# Altium schematic sheet FTDI.SchDoc
size B; SheetNumber: 5; SheetTotal: 7
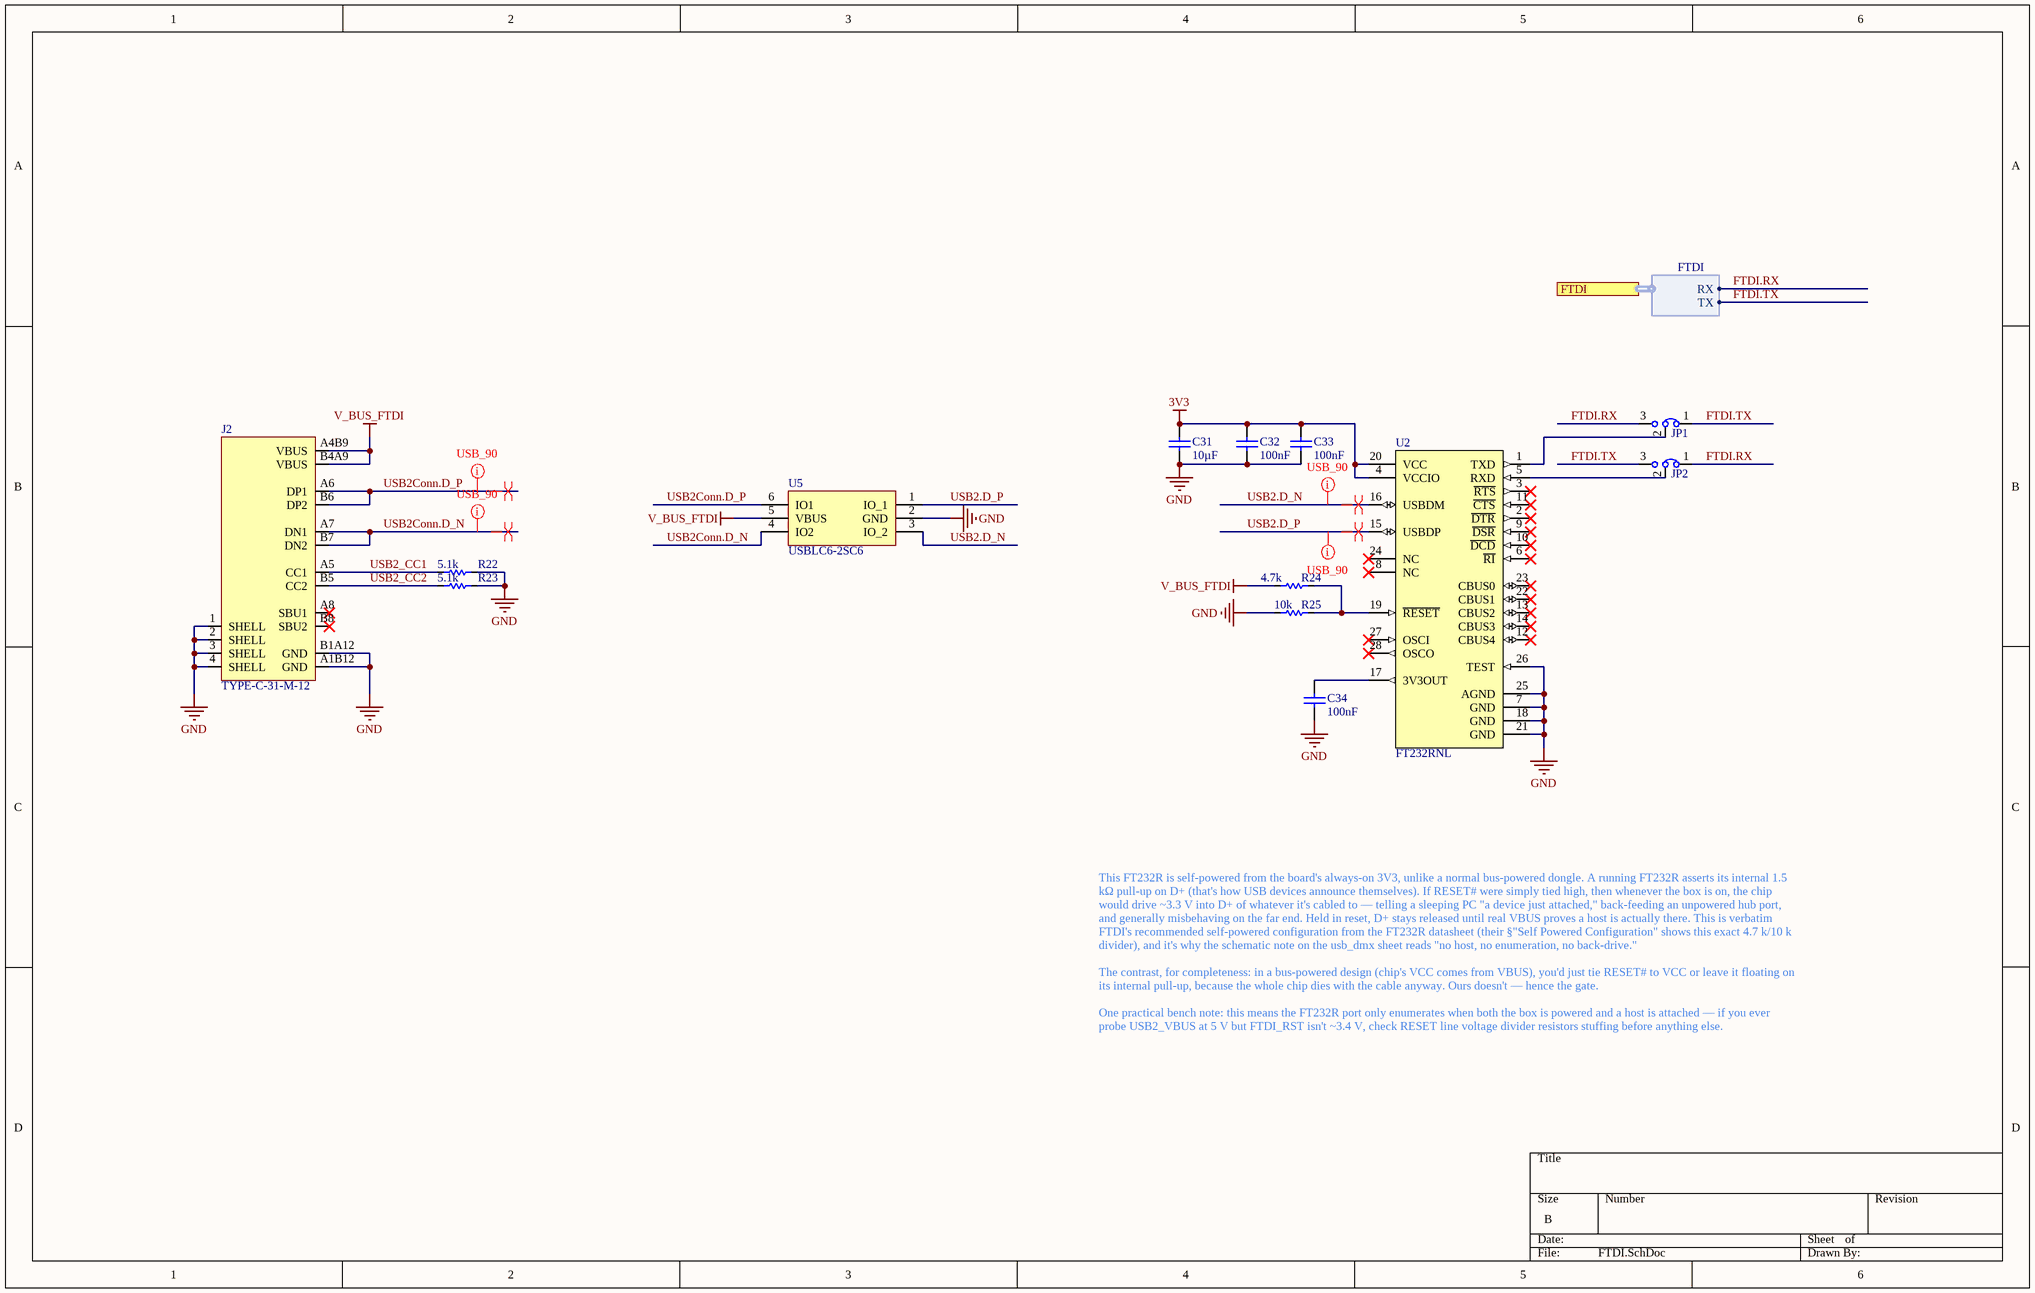
[diagram p0: FTDI.SchDoc]

## Parts
C31  value 10µF  [CAPC2012X14N_0805_MED]  (hidden comment: GRM21BC81C106KA73L)
C32  value 100nF  [CAPC1608X10N_0603_MED]  (hidden comment: CC0603KRX7R0BB104)
C33  value 100nF  [CAPC1608X10N_0603_MED]  (hidden comment: CC0603KRX7R0BB104)
C34  value 100nF  [CAPC1608X10N_0603_MED]  (hidden comment: CC0603KRX7R0BB104)
J2  TYPE-C-31-M-12  [Type-C-31-M-12]
JP1  Jumper 3 x 1 Bridge 1-2 Solder Bridge  [Jumper 3 Solder Bridge 1-2 0603]  (value not drawn)
JP2  Jumper 3 x 1 Bridge 1-2 Solder Bridge  [Jumper 3 Solder Bridge 1-2 0603]  (value not drawn)
R22  value 5.1k  [RESC1608X06N_0603_MED]  (hidden comment: RC0603FR-075K1L)
R23  value 5.1k  [RESC1608X06N_0603_MED]  (hidden comment: RC0603FR-075K1L)
R24  value 4.7k  [RESC1608X06N_0603_MED]  (hidden comment: RC0603FR-074K7L)
R25  value 10k  [RESC1608X06N_0603_MED]  (hidden comment: RC0603FR-1010KL)
U2  FT232RNL  [FP-FT232RNL-REEL-MFG]
U5  USBLC6-2SC6  [ESD_SOT23-6L]

## Ports
FTDI (harness FTDI)

## Harnesses
FTDI: RX, TX

## Nets
3V3: C31.2 C32.1 C33.1 U2.4(VCCIO) U2.20(VCC)
GND: C31.1 C32.2 C33.2 C34.2 J2.1(SHELL) J2.2(SHELL) J2.3(SHELL) J2.4(SHELL) J2.A1B12(GND) J2.B1A12(GND) R22.2 R23.2 R25.1 U2.7(GND) U2.18(GND) U2.21(GND) U2.25(AGND) U2.26(TEST) U5.2(GND)
V_BUS_FTDI: J2.A4B9(VBUS) J2.B4A9(VBUS) R24.2 U5.5(VBUS)
FTDI.RX: JP1.3 JP2.1 ; port FTDI.RX
FTDI.TX: JP1.1 JP2.3 ; port FTDI.TX
USB2.D_N: U2.16(USBDM) U5.3(IO_2)
USB2.D_P: U2.15(USBDP) U5.1(IO_1)
USB2_CC1: J2.A5(CC1) R22.1
USB2_CC2: J2.B5(CC2) R23.1
USB2Conn.D_N: J2.A7(DN1) J2.B7(DN2) U5.4(IO2)
USB2Conn.D_P: J2.A6(DP1) J2.B6(DP2) U5.6(IO1)
NetC34_1: C34.1 U2.17(3V3OUT)
NetJP1_2: JP1.2 U2.1(TXD)
NetJP2_2: JP2.2 U2.5(RXD)
NetR24_1: R24.1 R25.2 U2.19(~{RESET})

Not connected (* = marked no-connect by the designer): J2 A8(SBU1)* B8(SBU2)*; U2 2(~{DTR})* 3(~{RTS})* 6(~{RI})* 8(NC)* 9(~{DSR})* 10(~{DCD})* 11(~{CTS})* 12(CBUS4)* 13(CBUS2)* 14(CBUS3)* 22(CBUS1)* 23(CBUS0)* 24(NC)* 27(OSCI)* 28(OSCO)*

## Layout directives
rule Impedance Constraint [Min = 85.00    Max = 95.00    ]: USB2.D_N, USB2.D_P, USB2Conn.D_N, USB2Conn.D_P
differential pair; differential pair class 90DP: USB2.D_N, USB2.D_P, USB2Conn.D_N, USB2Conn.D_P

## Notes on the sheet
- This FT232R is self-powered from the board's always-on 3V3, unlike a normal bus-powered dongle. A running FT232R asserts its internal 1.5 kΩ pull-up on D+ (that's how USB devices announce themselves). If RESET# were simply tied high, then whenever the box is on, the chip would drive ~3.3 V into D+ of whatever it's cabled to — telling a sleeping PC "a device just attached," back-feeding an unpowered hub port, and generally misbehaving on the far end. Held in reset, D+ stays released until real VBUS proves a host is actually there. This is verbatim FTDI's recommended self-powered configuration from the FT232R datasheet (their §"Self Powered Configuration" shows this exact 4.7 k/10 k divider), and it's why the schematic note on the usb_dmx sheet reads "no host, no enumeration, no back-drive."
  The contrast, for completeness: in a bus-powered design (chip's VCC comes from VBUS), you'd just tie RESET# to VCC or leave it floating on its internal pull-up, because the whole chip dies with the cable anyway. Ours doesn't — hence the gate.
  One practical bench note: this means the FT232R port only enumerates when both the box is powered and a host is attached — if you ever probe USB2_VBUS at 5 V but FTDI_RST isn't ~3.4 V, check RESET line voltage divider resistors stuffing before anything else.
- Cage Code
- Important: This print and its subject matter is the property of Equus Compute Solutions ("ECS") and is to be held in strict confidence. It may contain proprietary information, trade secrets, and/or other intellectual property which are owned by ECS. It may only be used for the submitted purpose. This print is not to be forwarded to other parties nor reprinted in any form without ECS's permission.
- Project Name
- Engineer
- Checker
- Date
- Sheet Title
- Doc. No.
- Rev
- File
- Size
- B
- Sheet
- of

## Library data of the parts
C31 = CMP-001-00084-4: Ceramic Capacitor, Multilayer, Ceramic, 10uF, 16V, 10%, X6S, 0805; RoHS Compliant: Yes; Case/Package: 0805; Pins: 2; Min Operating Temperature: -55°C; Voltage Rating: 16V; JLCPN: C162413; Capacitor Type: Ceramic; Tolerance: 10%; Mounting Technology: Surface Mount; Max Operating Temperature: 105°C
C32-C34 = CMP-001-00102-4: Ceramic Capacitor, Multilayer, Ceramic, 100V, 10% +Tol, 10% -Tol, X7R, 15% TC, 0.1uF, Surface Mount, 0603; Max Operating Temperature: 125°C; RoHS Compliant: Yes; Case/Package: 0603; Mounting Technology: Surface Mount; Capacitor Type: Ceramic; Pins: 2; Voltage Rating: 100V; Min Operating Temperature: -55°C; JLCPN: C113803
J2 = CMP-002-00236-8: 20V USB C 2.0 16P Female header; JLCPN: C165948
JP1 JP2 = CMP-009-00341-2: 0603 Solder Bridge Jumper Surface Mount; Tolerance: 1%; Voltage Rating: 75V; Value: 0; Pins: 2; Case/Package: 0603; RoHS Compliant: Yes; Max Operating Temperature: 155°C; Min Operating Temperature: -55°C; Mounting Technology: Surface Mount
R22 R23 = CMP-009-00331-3: Fixed Resistor, Metal Glaze/thick Film, 0.1W, 5100ohm, 75V, 1% +/-Tol, 100ppm/Cel, Surface Mount, 0603; Power: 100mW; JLCPN: C23186; Case/Package: 0603; Tolerance: 1%; Voltage Rating: 75V; Pins: 2; RoHS Compliant: Yes; Max Operating Temperature: 155°C; Mounting Technology: Surface Mount; Min Operating Temperature: -55°C
R24 = CMP-009-00343-1: Fixed Resistor, Metal Glaze/thick Film, 0.1W, 4700ohm, 75V, 1% +/-Tol, 100ppm/Cel, Surface Mount, 0603; Power: 100mW; Tolerance: 1%; Case/Package: 0603; Pins: 2; RoHS Compliant: Yes; Mounting Technology: Surface Mount; Voltage Rating: 75V; Max Operating Temperature: 155°C; Min Operating Temperature: -55°C
R25 = CMP-009-00306-2: Fixed Resistor, Metal Glaze/thick Film, 0.1W, 10000ohm, 75V, 1% +/-Tol, 100ppm/Cel, Surface Mount, 0603; Power: 100mW; Voltage Rating: 50V; Max Operating Temperature: 155°C; Min Operating Temperature: -55°C; JLCPN: C98220; Mounting Technology: Surface Mount; Case/Package: 0603; Tolerance: 1%; RoHS Compliant: Yes; Pins: 2
U2 = CMP-015-00034-4: Integrated Circuit Interface USB-UART; RS-232; 12Mbs; 3.3-5.25V; -40+85 deg.C; SMD; SSOP28; Min Supply Voltage: 3.3V; Max Supply Voltage: 5.25V; Min Operating Temperature: -40°C; Pins: 28; Max Operating Temperature: 85°C; Mounting Technology: Surface Mount; Case/Package: SSOP
U5 = CMP-128-000006-4: Very low capacitance ESD protection; Part_Type: IC; Manufacturer: STMICROELECTRONICS; Value: USBLC6-2SC6; Manufacturer_Part_Number: USBLC6-2SC6; JLCPN: C7519